# EasyEDA Pro project ProPrj_DiscoTech 6 Current_2026-05-06.epro, schematic Input

## Sheets
1 Volume/EQ: Board Name: Input; Create Date: 2025-11-03; Page Name: Volume/EQ; Project Name: DiscoTech 6 Current; Schematic Name: Input; Update Date: 2026-04-29; Company: EasyEDA.com; Page Size: A4; Version: V1.0
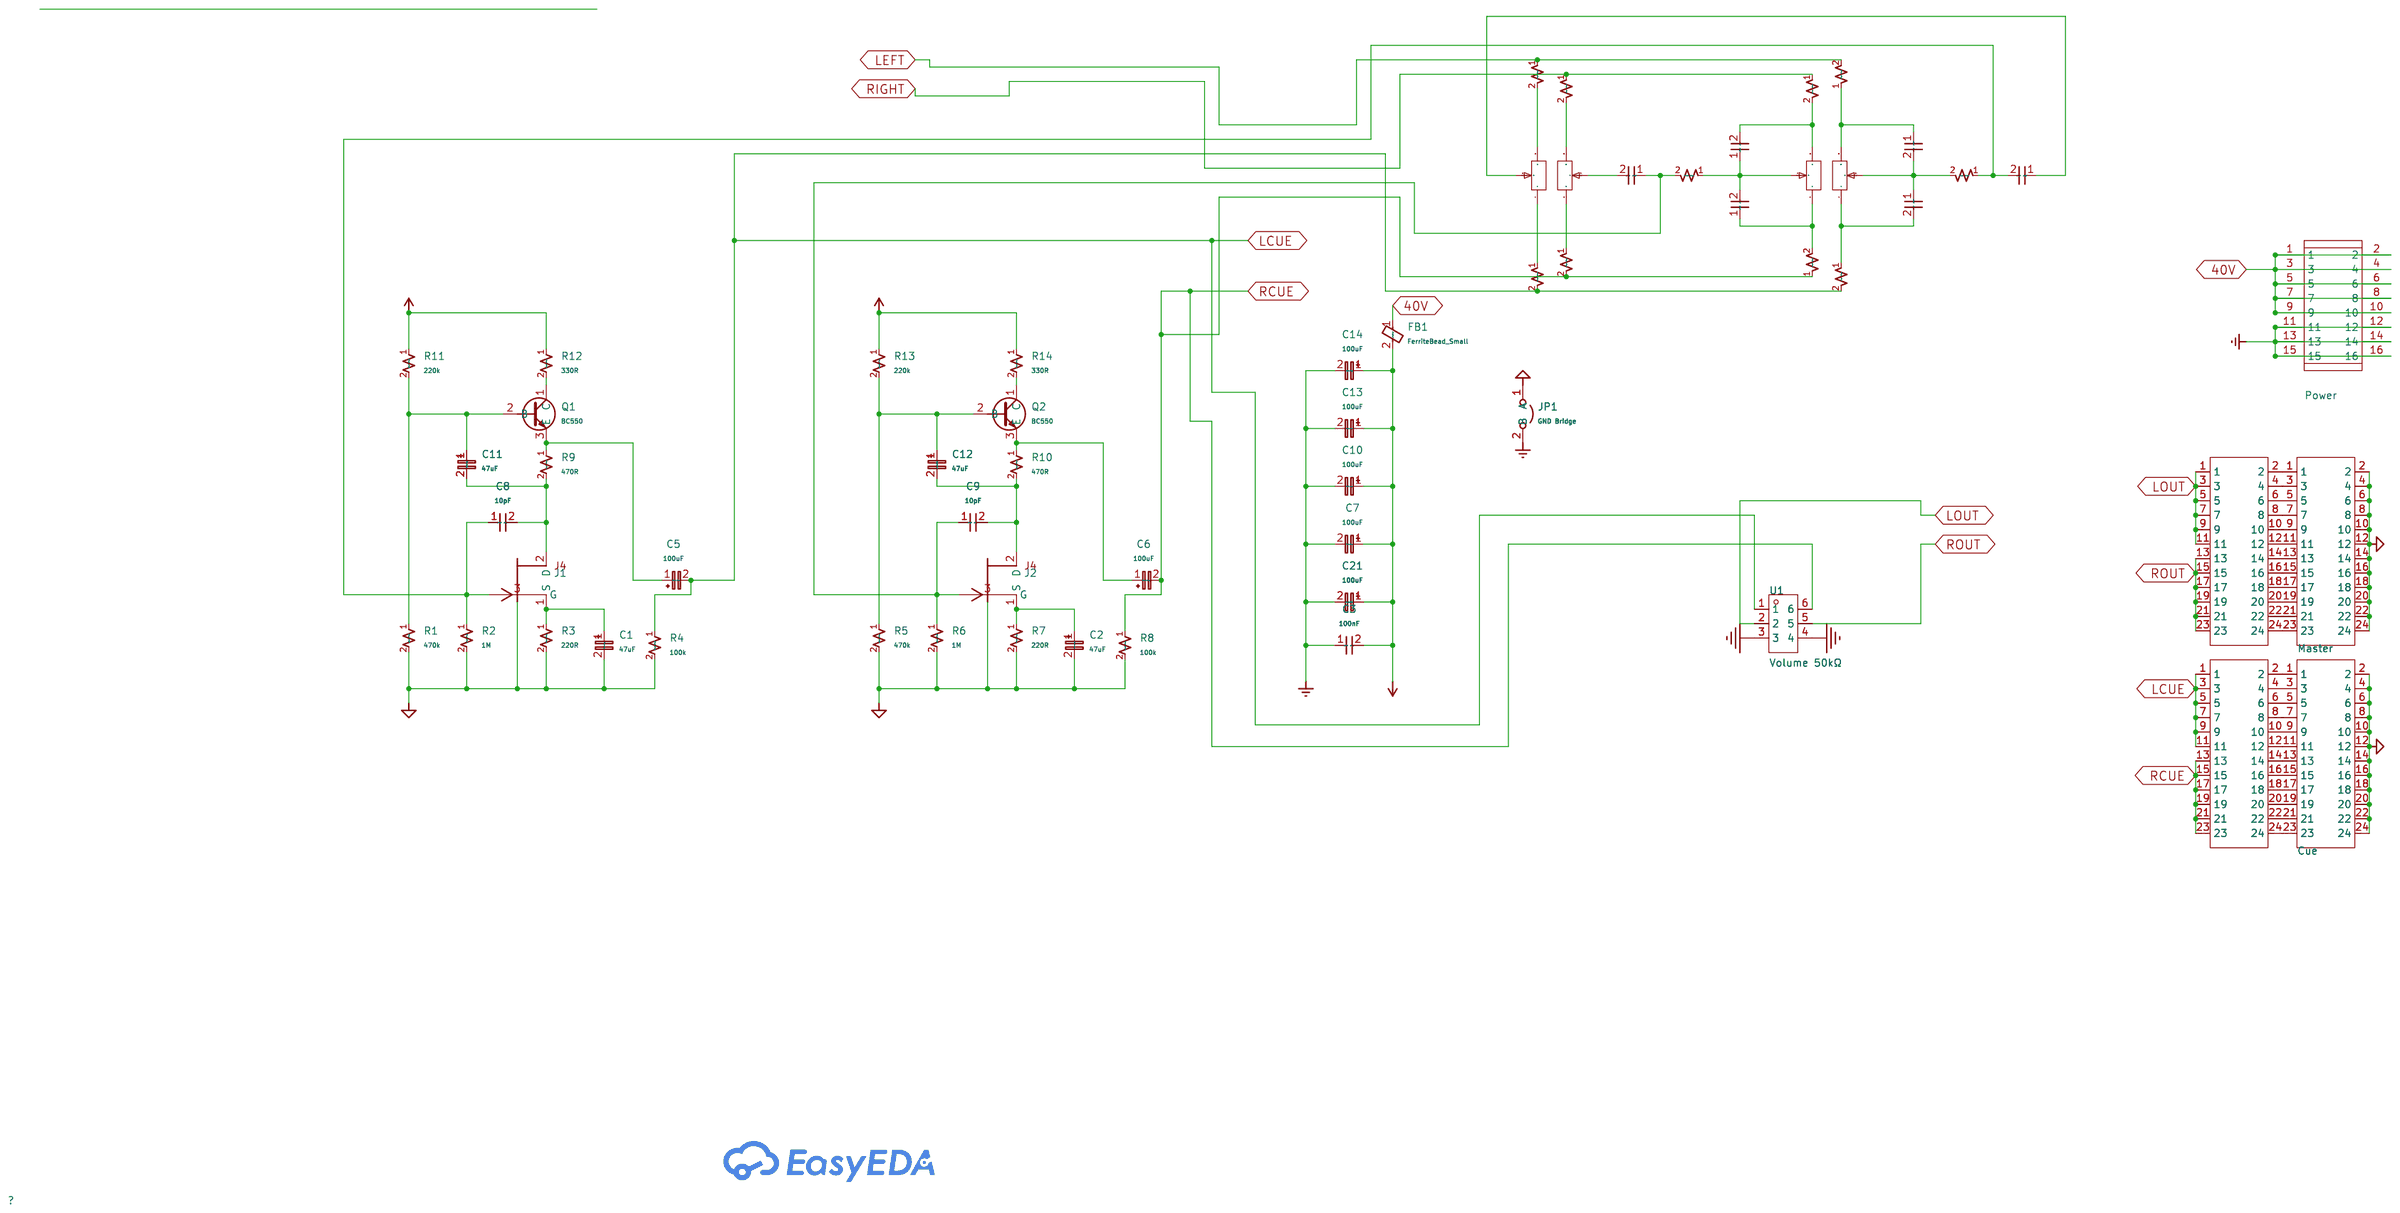
[diagram p6: Volume/EQ]
2 Phono: Page Name: Phono
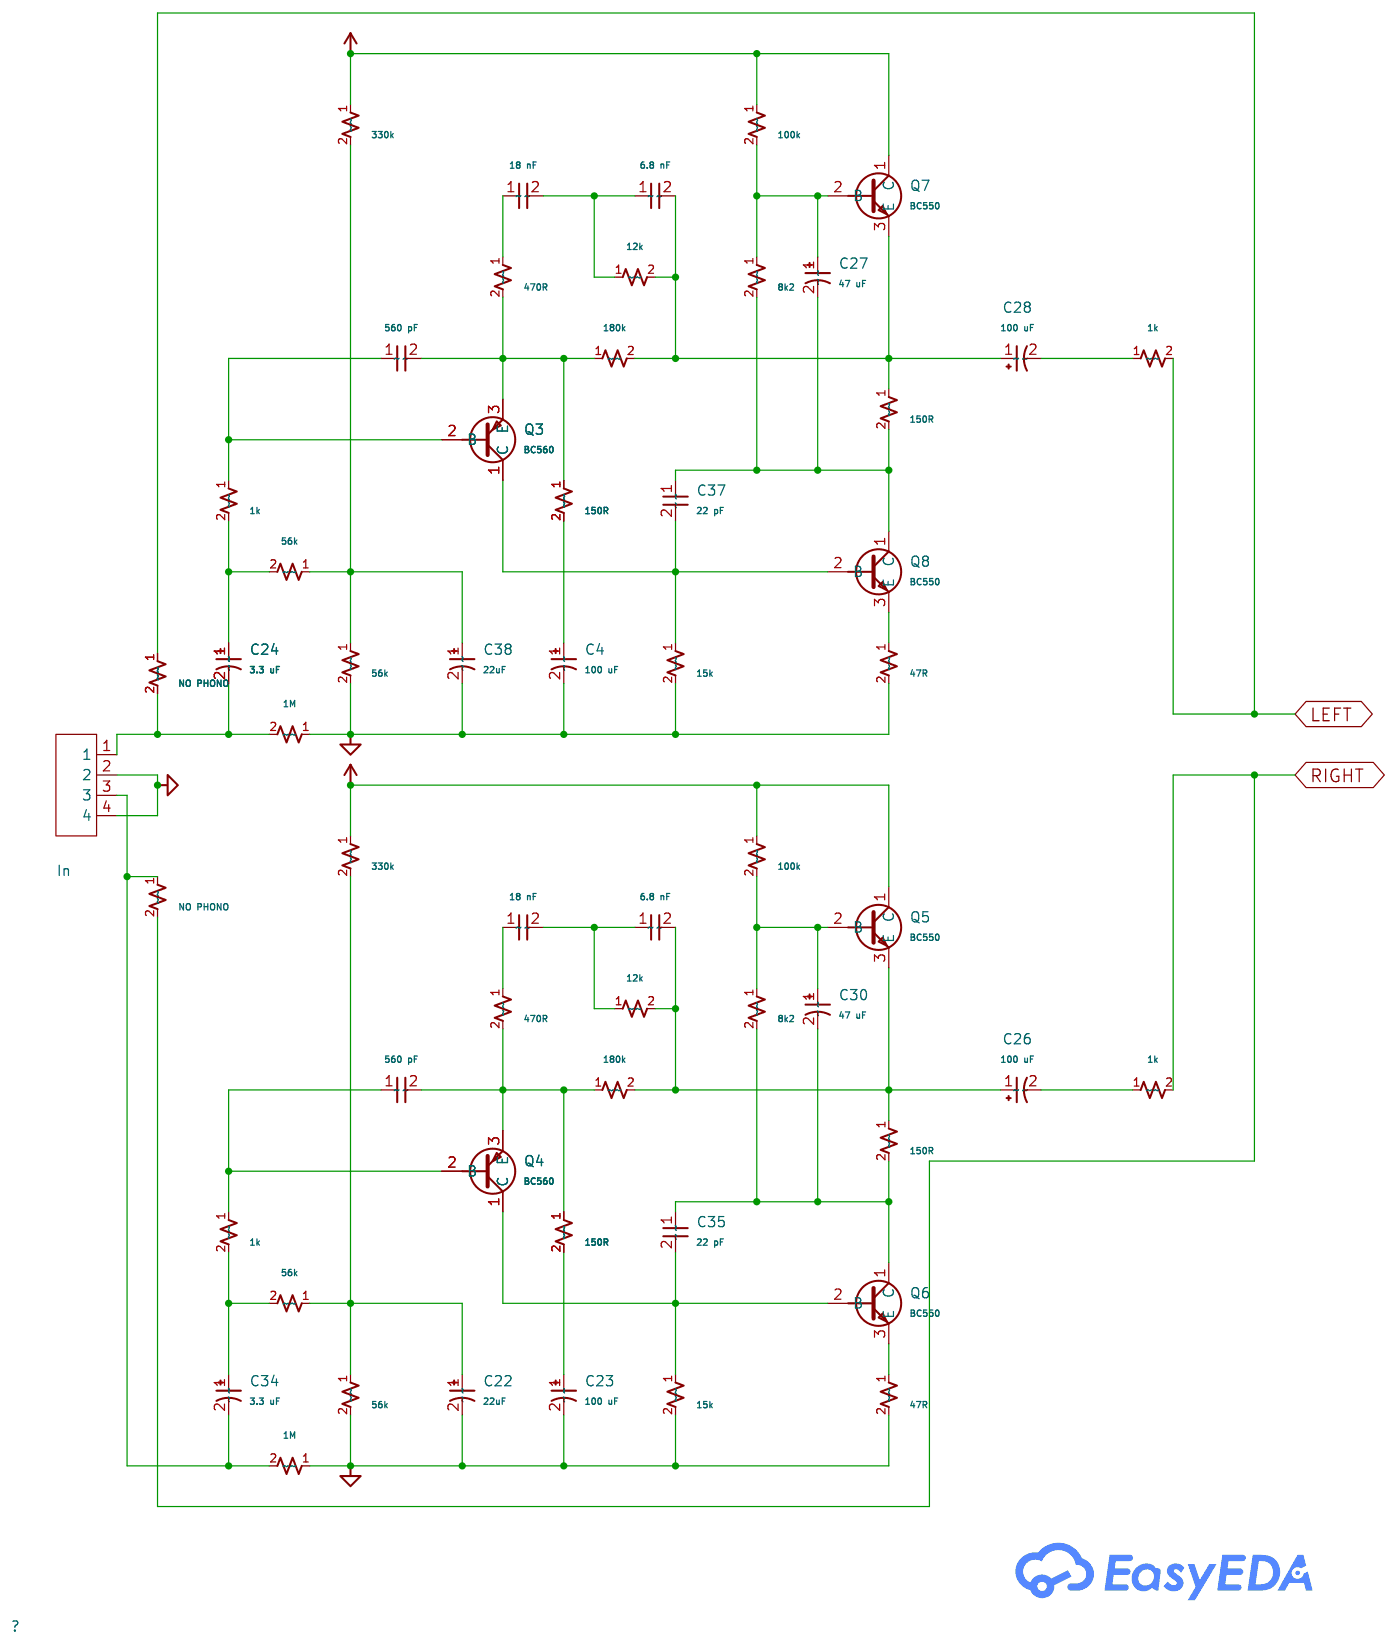
[diagram p7: Phono]

## Parts
sheet Phono
C4  100 uF  [Capacitor_THT:CP_Radial_D10.0mm_P5.00mm]
C22  22uF  [Capacitor_THT:CP_Radial_D6.3mm_P2.50mm]
C23  100 uF  [Capacitor_THT:CP_Radial_D10.0mm_P5.00mm]
C24  3.3 uF  [Capacitor_THT:CP_Radial_Tantal_D5.0mm_P5.00mm]
C25  560 pF  [Capacitor_THT:C_Rect_L10.0mm_W4.0mm_P7.50mm_FKS3_FKP3]
C26  100 uF  [Capacitor_THT:CP_Radial_D10.0mm_P5.00mm]
C27  47 uF  [Capacitor_THT:CP_Radial_D6.3mm_P2.50mm]
C28  100 uF  [Capacitor_THT:CP_Radial_D10.0mm_P5.00mm]
C29  6.8 nF  [Capacitor_THT:C_Rect_L13.0mm_W4.0mm_P10.00mm_FKS3_FKP3_MKS4]
C30  47 uF  [Capacitor_THT:CP_Radial_D6.3mm_P2.50mm]
C31  560 pF  [Capacitor_THT:C_Rect_L10.0mm_W4.0mm_P7.50mm_FKS3_FKP3]
C32  18 nF  [Capacitor_THT:C_Rect_L13.0mm_W6.0mm_P10.00mm_FKS3_FKP3_MKS4]
C33  6.8 nF  [Capacitor_THT:C_Rect_L13.0mm_W4.0mm_P10.00mm_FKS3_FKP3_MKS4]
C34  3.3 uF  [Capacitor_THT:CP_Radial_Tantal_D5.0mm_P5.00mm]
C35  22 pF  [Capacitor_THT:C_Disc_D3.8mm_W2.6mm_P2.50mm]
C36  18 nF  [Capacitor_THT:C_Rect_L13.0mm_W6.0mm_P10.00mm_FKS3_FKP3_MKS4]
C37  22 pF  [Capacitor_THT:C_Disc_D3.8mm_W2.6mm_P2.50mm]
C38  22uF  [Capacitor_THT:CP_Radial_D6.3mm_P2.50mm]
Q3  BC560  [TO-92-3_L4.8-W3.7-P2.60-L_LP0003A]
Q4  BC560  [TO-92-3_L4.8-W3.7-P2.60-L_LP0003A]
Q5  BC550  [TO-92-3_L4.8-W3.7-P2.60-L_LP0003A]
Q6  BC550  [TO-92-3_L4.8-W3.7-P2.60-L_LP0003A]
Q7  BC550  [TO-92-3_L4.8-W3.7-P2.60-L_LP0003A]
Q8  BC550  [TO-92-3_L4.8-W3.7-P2.60-L_LP0003A]
R27  8k2  [Resistor_THT:R_Axial_DIN0207_L6.3mm_D2.5mm_P7.62mm_Horizontal]
R28  150R  [Resistor_THT:R_Axial_DIN0207_L6.3mm_D2.5mm_P7.62mm_Horizontal]
R29  47R  [Resistor_THT:R_Axial_DIN0207_L6.3mm_D2.5mm_P7.62mm_Horizontal]
R30  1k  [Resistor_THT:R_Axial_DIN0207_L6.3mm_D2.5mm_P7.62mm_Horizontal]
R31  56k  [Resistor_THT:R_Axial_DIN0207_L6.3mm_D2.5mm_P7.62mm_Horizontal]
R32  56k  [Resistor_THT:R_Axial_DIN0207_L6.3mm_D2.5mm_P7.62mm_Horizontal]
R33  180k  [Resistor_THT:R_Axial_DIN0207_L6.3mm_D2.5mm_P7.62mm_Horizontal]
R34  150R  [Resistor_THT:R_Axial_DIN0207_L6.3mm_D2.5mm_P7.62mm_Horizontal]
R35  56k  [Resistor_THT:R_Axial_DIN0207_L6.3mm_D2.5mm_P7.62mm_Horizontal]
R36  56k  [Resistor_THT:R_Axial_DIN0207_L6.3mm_D2.5mm_P7.62mm_Horizontal]
R37  180k  [Resistor_THT:R_Axial_DIN0207_L6.3mm_D2.5mm_P7.62mm_Horizontal]
R38  470R  [Resistor_THT:R_Axial_DIN0207_L6.3mm_D2.5mm_P7.62mm_Horizontal]
R39  1M  [Resistor_THT:R_Axial_DIN0207_L6.3mm_D2.5mm_P7.62mm_Horizontal]
R40  1k  [Resistor_THT:R_Axial_DIN0207_L6.3mm_D2.5mm_P7.62mm_Horizontal]
R41  330k  [Resistor_THT:R_Axial_DIN0207_L6.3mm_D2.5mm_P7.62mm_Horizontal]
R42  12k  [Resistor_THT:R_Axial_DIN0207_L6.3mm_D2.5mm_P7.62mm_Horizontal]
R43  1k  [Resistor_THT:R_Axial_DIN0207_L6.3mm_D2.5mm_P7.62mm_Horizontal]
R44  47R  [Resistor_THT:R_Axial_DIN0207_L6.3mm_D2.5mm_P7.62mm_Horizontal]
R45  150R  [Resistor_THT:R_Axial_DIN0207_L6.3mm_D2.5mm_P7.62mm_Horizontal]
R46  15k  [Resistor_THT:R_Axial_DIN0207_L6.3mm_D2.5mm_P7.62mm_Horizontal]
R47  470R  [Resistor_THT:R_Axial_DIN0207_L6.3mm_D2.5mm_P7.62mm_Horizontal]
R48  100k  [Resistor_THT:R_Axial_DIN0207_L6.3mm_D2.5mm_P7.62mm_Horizontal]
R49  330k  [Resistor_THT:R_Axial_DIN0207_L6.3mm_D2.5mm_P7.62mm_Horizontal]
R50  15k  [Resistor_THT:R_Axial_DIN0207_L6.3mm_D2.5mm_P7.62mm_Horizontal]
R51  150R  [Resistor_THT:R_Axial_DIN0207_L6.3mm_D2.5mm_P7.62mm_Horizontal]
R52  8k2  [Resistor_THT:R_Axial_DIN0207_L6.3mm_D2.5mm_P7.62mm_Horizontal]
R53  100k  [Resistor_THT:R_Axial_DIN0207_L6.3mm_D2.5mm_P7.62mm_Horizontal]
R54  1M  [Resistor_THT:R_Axial_DIN0207_L6.3mm_D2.5mm_P7.62mm_Horizontal]
R55  12k  [Resistor_THT:R_Axial_DIN0207_L6.3mm_D2.5mm_P7.62mm_Horizontal]
R56  1k  [Resistor_THT:R_Axial_DIN0207_L6.3mm_D2.5mm_P7.62mm_Horizontal]
R57  NO PHONO  [Resistor_THT:R_Axial_DIN0207_L6.3mm_D2.5mm_P7.62mm_Horizontal]
R58  NO PHONO  [Resistor_THT:R_Axial_DIN0207_L6.3mm_D2.5mm_P7.62mm_Horizontal]
U2  In  [CONN-TH_4P-P2.54_MX128-2.54-GN01-04P-CU-Y-A]
sheet Volume/EQ
C1  47uF  [Capacitor_THT:CP_Radial_D6.3mm_P2.50mm]
C2  47uF  [Capacitor_THT:CP_Radial_D6.3mm_P2.50mm]
C3  100nF  [Capacitor_THT:C_Rect_L7.2mm_W2.5mm_P5.00mm_FKS2_FKP2_MKS2_MKP2]
C5  100uF  [Capacitor_THT:CP_Radial_D10.0mm_P5.00mm]
C6  100uF  [Capacitor_THT:CP_Radial_D10.0mm_P5.00mm]
C7  100uF  [Capacitor_THT:CP_Radial_D10.0mm_P5.00mm]
C8  10pF  [Capacitor_THT:C_Disc_D3.8mm_W2.6mm_P2.50mm]
C9  10pF  [Capacitor_THT:C_Disc_D3.8mm_W2.6mm_P2.50mm]
C10  100uF  [Capacitor_THT:CP_Radial_D10.0mm_P5.00mm]
C11  47uF  [Capacitor_THT:CP_Radial_D6.3mm_P2.50mm]
C12  47uF  [Capacitor_THT:CP_Radial_D6.3mm_P2.50mm]
C13  100uF  [Capacitor_THT:CP_Radial_D10.0mm_P5.00mm]
C14  100uF  [Capacitor_THT:CP_Radial_D10.0mm_P5.00mm]
C15  68nF  [Capacitor_THT:C_Rect_L13.0mm_W6.0mm_P10.00mm_FKS3_FKP3_MKS4]
C16  2.2nF  [Capacitor_THT:C_Rect_L10.0mm_W4.0mm_P7.50mm_FKS3_FKP3]
C17  68nF  [Capacitor_THT:C_Rect_L13.0mm_W6.0mm_P10.00mm_FKS3_FKP3_MKS4]
C18  68nF  [Capacitor_THT:C_Rect_L13.0mm_W6.0mm_P10.00mm_FKS3_FKP3_MKS4]
C19  68nF  [Capacitor_THT:C_Rect_L13.0mm_W6.0mm_P10.00mm_FKS3_FKP3_MKS4]
C20  2.2nF  [Capacitor_THT:C_Rect_L10.0mm_W4.0mm_P7.50mm_FKS3_FKP3]
C21  100uF  [Capacitor_THT:CP_Radial_D10.0mm_P5.00mm]
FB1  FerriteBead_Small  [Inductor_THT:L_Axial_L9.5mm_D4.0mm_P12.70mm_Horizontal_Fastron_SMCC]
H3  PZ254V-12-24P  [HDR-TH_24P-P2.54-V-M-R2-C12-S2.54]
H4  PZ254V-12-24P  [HDR-TH_24P-P2.54-V-M-R2-C12-S2.54]
J1  -  [2n3822]
J2  -  [2n3822]
JP1  GND Bridge  [Connector_PinHeader_2.54mm:PinHeader_1x02_P2.54mm_Vertical]
P1  Power  [CONN-TH_16P-P2.54_C9142]
P2  Master  [IDC-TH_24P-P2.54_ZHOURI_DC3-2.54-24PAL]
P3  Cue  [IDC-TH_24P-P2.54_ZHOURI_DC3-2.54-24PAL]
Q1  BC550  [TO-92-3_L4.8-W3.7-P2.60-L_LP0003A]
Q2  BC550  [TO-92-3_L4.8-W3.7-P2.60-L_LP0003A]
R1  470k  [Resistor_THT:R_Axial_DIN0207_L6.3mm_D2.5mm_P7.62mm_Horizontal]
R2  1M  [Resistor_THT:R_Axial_DIN0207_L6.3mm_D2.5mm_P7.62mm_Horizontal]
R3  220R  [Resistor_THT:R_Axial_DIN0207_L6.3mm_D2.5mm_P7.62mm_Horizontal]
R4  100k  [Resistor_THT:R_Axial_DIN0207_L6.3mm_D2.5mm_P7.62mm_Horizontal]
R5  470k  [Resistor_THT:R_Axial_DIN0207_L6.3mm_D2.5mm_P7.62mm_Horizontal]
R6  1M  [Resistor_THT:R_Axial_DIN0207_L6.3mm_D2.5mm_P7.62mm_Horizontal]
R7  220R  [Resistor_THT:R_Axial_DIN0207_L6.3mm_D2.5mm_P7.62mm_Horizontal]
R8  100k  [Resistor_THT:R_Axial_DIN0207_L6.3mm_D2.5mm_P7.62mm_Horizontal]
R9  470R  [Resistor_THT:R_Axial_DIN0207_L6.3mm_D2.5mm_P7.62mm_Horizontal]
R10  470R  [Resistor_THT:R_Axial_DIN0207_L6.3mm_D2.5mm_P7.62mm_Horizontal]
R11  220k  [Resistor_THT:R_Axial_DIN0207_L6.3mm_D2.5mm_P7.62mm_Horizontal]
R12  330R  [Resistor_THT:R_Axial_DIN0207_L6.3mm_D2.5mm_P7.62mm_Horizontal]
R13  220k  [Resistor_THT:R_Axial_DIN0207_L6.3mm_D2.5mm_P7.62mm_Horizontal]
R14  330R  [Resistor_THT:R_Axial_DIN0207_L6.3mm_D2.5mm_P7.62mm_Horizontal]
R15  Bass 50kΩ  [RES-ADJ-TH_RK16312A0BKH]
R16  Treble 50kΩ  [RES-ADJ-TH_RK16312A0BKH]
R17  6k8  [Resistor_THT:R_Axial_DIN0207_L6.3mm_D2.5mm_P7.62mm_Horizontal]
R18  12k  [Resistor_THT:R_Axial_DIN0207_L6.3mm_D2.5mm_P7.62mm_Horizontal]
R19  3k3  [Resistor_THT:R_Axial_DIN0207_L6.3mm_D2.5mm_P7.62mm_Horizontal]
R20  12k  [Resistor_THT:R_Axial_DIN0207_L6.3mm_D2.5mm_P7.62mm_Horizontal]
R21  12k  [Resistor_THT:R_Axial_DIN0207_L6.3mm_D2.5mm_P7.62mm_Horizontal]
R22  12k  [Resistor_THT:R_Axial_DIN0207_L6.3mm_D2.5mm_P7.62mm_Horizontal]
R23  6k8  [Resistor_THT:R_Axial_DIN0207_L6.3mm_D2.5mm_P7.62mm_Horizontal]
R24  3k3  [Resistor_THT:R_Axial_DIN0207_L6.3mm_D2.5mm_P7.62mm_Horizontal]
R25  3k3  [Resistor_THT:R_Axial_DIN0207_L6.3mm_D2.5mm_P7.62mm_Horizontal]
R26  3k3  [Resistor_THT:R_Axial_DIN0207_L6.3mm_D2.5mm_P7.62mm_Horizontal]
U1  Volume 50kΩ  [RES-ADJ-TH_RK27112A0A16]

## Library data of the parts
C4 C22-C24 C26-C28 C30 C34 C38 = Device_C_Polarized_Small_US: Polarized capacitor, small US symbol; Users: REF**
C3 C8 C9 C15-C20 C25 C29 C31-C33 C35-C37 = Device_C_Small: Unpolarized capacitor, small symbol; Users: REF**
Q3 Q4 = Transistor_BJT_BC560: 0.1A Ic, 45V Vce, PNP Small Signal Transistor, TO-92; Users: REF**; datasheet: https://www.onsemi.com/pub/Collateral/BC550-D.pdf; User doc link: https://www.onsemi.com/pub/Collateral/BC556BTA-D.pdf
Q1 Q2 Q5-Q8 = Transistor_BJT_BC550: 0.1A Ic, 45V Vce, Small Signal NPN Transistor, TO-92; User doc link: https://www.onsemi.com/pub/Collateral/BC550-D.pdf
R1-R14 R17-R58 = Device_R_Small_US: Resistor, small US symbol; Users: REF**
U2 = MX128-2.54-04P-GN01-Cu-Y-A: Number of Positions or Pins:1x4P Pitch:2.54mm Color:Green Mounting Type:Direct Insert Number of Pins:4P Number of Rows:1 Number of PINs Per Row:4 Screw Specification:M1.6 Current Rating:6A Voltage Rating (Max):150V Wire Gauge - AWG:18~24 Wire Gauge - AWG:; LCSC Part Name: 1x4P 2.54mm 直插 排数:1 每排P数:4; Supplier Part: C5188444; Manufacturer: MAX(迈旭); Supplier Footprint: 插件,P=2.54mm; JLCPCB Part Class: Extended Part; Datasheet: https://atta.szlcsc.com/upload/public/pdf/source/20250320/39CF67EAC718F5AC600D0D1AE915BA0E.pdf; Supplier: LCSC; Number of Positions or Pins: 1x4P; Pitch: 2.54mm; Color: Green; Mounting Type: Direct Insert; Number of Pins: 4P; Number of Rows: 1; Number of PINs Per Row: 4; Screw Specification: M1.6; Current Rating: 6A; Voltage Rating (Max): 150V; Wire Gauge - AWG: 18~24; Wire Gauge - mm2: 1; Operating Temperature: -40℃~+105℃
C1 C2 C5-C7 C10-C14 C21 = Device_C_Polarized_Small: Polarized capacitor, small symbol; Users: REF**
FB1 = Device_FerriteBead_Small: Ferrite bead, small symbol; Users: REF**
H3 H4 = PZ254V-12-24P: Pin Structure:2x12P Pitch:2.54mm Row Spacing:2.54mm Circluar Pins/Square Pins:Pin Header Mounting Type:Through Hole Number of Rows:2 Number of Pins:24P Current Rating:- Voltage Rating (Max):- Length of Mating Pin:6mm Insulation Height:2.5mm Length of End; LCSC Part Name: 2x12P 间距:2.54mm 方针 直插; Supplier Part: C492429; Manufacturer: XFCN(兴飞); Supplier Footprint: 插件,P=2.54mm; JLCPCB Part Class: Extended Part; Datasheet: https://item.szlcsc.com/datasheet/PZ254V-12-24P/502985.html; Supplier: LCSC; Pin Structure: 2x12P; Pitch: 2.54mm; Row Spacing: 2.54mm; Circluar Pins/Square Pins: Pin Header; Mounting Type: Through Hole; Number of Rows: 2; Number of Pins: 24P; Length of Mating Pin: 6mm; Insulation Height: 2.5mm; Length of End Connection Pin: 3mm; Contact Material: Brass; Operating Temperature: -40℃~+105℃; Color: Black
J1 J2 = 2n3822
JP1 = Jumper_Jumper_2_Open: Jumper, 2-pole, open; Users: REF**
P1 = 2.54-2*8P弯简牛: Connector Type:IDC Header Pitch:2.54mm Number of Positions or Pins:2x8P Holder Type:Right Angle Row Spacing:2.54mm Number of Rows:2 Number of PINs Per Row:8 Contact Material:- Contact Plating:-; LCSC Part Name: 2.54mm 2x8P 排数:2 每排P数:8; Supplier Part: C9142; Manufacturer: BOOMELE(博穆精密); Supplier Footprint: 弯插,P=2.54mm; JLCPCB Part Class: Extended Part; Datasheet: https://item.szlcsc.com/datasheet/2.54-2*8P%25E5%25BC%25AF%25E7%25AE%2580%25E7%2589%259B/9665.html; Supplier: LCSC; Connector Type: IDC Header; Pitch: 2.54mm; Number of Positions or Pins: 2x8P; Holder Type: Right Angle; Row Spacing: 2.54mm; Number of Rows: 2; Number of PINs Per Row: 8
P2 P3 = DS1013-24RSiB-B-0: Connector Type:IDC Header Pitch:2.54mm Number of Positions or Pins:2x12P Holder Type:Right Angle Number of Rows:2 Number of PINs Per Row:12; LCSC Part Name: 2.54mm 2x12P 排数:2 每排P数:12; Supplier Part: C7430325; Manufacturer: CONNFLY; Supplier Footprint: 弯插,P=2.54mm; JLCPCB Part Class: Extended Part; Datasheet: https://item.szlcsc.com/datasheet/DS1013-24RSiB-B-0/8429959.html; Supplier: LCSC; Connector Type: IDC Header; Pitch: 2.54mm; Number of Positions or Pins: 2x12P; Holder Type: Right Angle; Number of Rows: 2; Number of PINs Per Row: 12; Row Spacing: 2.54mm
R15 R16 = RK16312A0BKH: Resistance: Tolerance:±20% Tolerance:±20%; LCSC Part Name: 50kΩ ±20% 停产; Supplier Part: C231749; Manufacturer: ALPSALPINE(阿尔卑斯阿尔派); Supplier Footprint: 插件; JLCPCB Part Class: Extended Part; Datasheet: https://atta.szlcsc.com/upload/public/pdf/source/20180613/C231749_F0A00B2AA60C42757A3F15B1E5114770.pdf; Supplier: LCSC; Tolerance: ±20%
U1 = RK27112A0A16: Resistance: Tolerance:±20% Tolerance:±20% Rated Voltage:- Power(Watts):- Turns:-; LCSC Part Name: 100kΩ ±20% 3件套; Supplier Part: C470508; Manufacturer: ALPSALPINE(阿尔卑斯阿尔派); Supplier Footprint: DIP-6P,27x24.5mm; JLCPCB Part Class: Extended Part; Datasheet: https://atta.szlcsc.com/upload/public/pdf/source/20191216/C470509_1AC214E673023FF0853974852A92149F.pdf; Supplier: LCSC; Tolerance: ±20%

## Nets
40V: FB1.1 P1.1 P1.2 P1.3 P1.4 P1.5 P1.6 P1.7 P1.8 P1.9 P1.10
GNDREF: C3.1 C7.2 C10.2 C13.2 C14.2 C21.2 JP1.2(B) P1.11 P1.12 P1.13 P1.14 P1.15 P1.16
GNDS: C1.2 C2.2 C4.2 C22.2 C23.2 C38.2 JP1.1(A) P2.2 P2.4 P2.6 P2.8 P2.10 P2.12 P2.14 P2.16 P2.18 P2.20 P2.22 P2.24 P3.2 P3.4 P3.6 P3.8 P3.10 P3.12 P3.14 P3.16 P3.18 P3.20 P3.22 P3.24 R1.2 R2.2 R3.2 R4.2 R5.2 R6.2 R7.2 R8.2 R29.2 R32.2 R36.2 R39.1 R44.2 R46.2 R50.2 R54.1 U1.3 U1.4 U2.2 U2.4
LCUE: C5.2 H4.1 H4.3 H4.5 H4.7 H4.9 H4.11 R4.1 R20.2 R26.2 U1.1
LEFT: R22.2 R25.1 R56.2 R57.1
LOUT: H3.1 H3.3 H3.5 H3.7 H3.9 H3.11 U1.2
RCUE: C6.2 H4.13 H4.15 H4.17 H4.19 H4.21 H4.23 R8.1 R18.1 R24.2 U1.6
RIGHT: R19.1 R21.1 R30.2 R58.2
ROUT: H3.13 H3.15 H3.17 H3.19 H3.21 H3.23 U1.5
VDC: C3.2 C7.1 C10.1 C13.1 C14.1 C21.1 FB1.2 Q5.1(C) Q7.1(C) R11.1 R12.1 R13.1 R14.1 R41.1 R48.1 R49.1 R53.1
$1N449: C8.1 C20.2 J1.3(G) R2.1 R23.1
$1N454: C8.2 C11.2 J1.2(D) R9.2
$1N461: C5.1 Q1.3(E) R9.1
$1N470: C11.1 Q1.2(B) R1.1 R11.2
$1N476: C1.1 J1.1(S) R3.1
$1N480: Q1.1(C) R12.2
$1N855: C9.1 C16.1 J2.3(G) R6.1 R17.2
$1N860: C9.2 C12.2 J2.2(D) R10.2
$1N867: C6.1 Q2.3(E) R10.1
$1N876: C12.1 Q2.2(B) R5.1 R13.2
$1N882: C2.1 J2.1(S) R7.1
$1N886: Q2.1(C) R14.2
$1N6655: C18.1 R15.6 R22.1
$1N6656: C19.2 R15.4 R20.1
$1N6657: C18.2 C19.1 R15.5 R23.2
$1N6659: C15.2 R15.3 R21.2
$1N6660: C17.1 R15.1 R18.2
$1N6661: C15.1 C17.2 R15.2 R17.1
$1N6663: C16.2 R16.2
$1N6664: C20.1 R16.5
$1N6665: R16.3 R19.2
$1N6666: R16.1 R24.1
$1N6667: R16.4 R26.1
$1N6668: R16.6 R25.2
$1N19497: H3.24 P2.23
$1N19499: H3.22 P2.21
$1N19501: H3.20 P2.19
$1N19503: H3.18 P2.17
$1N19505: H3.16 P2.15
$1N19507: H3.14 P2.13
$1N19509: H3.12 P2.11
$1N19511: H3.10 P2.9
$1N19513: H3.8 P2.7
$1N19515: H3.6 P2.5
$1N19517: H3.4 P2.3
$1N19519: H3.2 P2.1
$1N19633: H4.24 P3.23
$1N19635: H4.22 P3.21
$1N19637: H4.20 P3.19
$1N19639: H4.18 P3.17
$1N19641: H4.16 P3.15
$1N19643: H4.14 P3.13
$1N19645: H4.12 P3.11
$1N19647: H4.10 P3.9
$1N19649: H4.8 P3.7
$1N19651: H4.6 P3.5
$1N19653: H4.4 P3.3
$1N19655: H4.2 P3.1
$2N1482: C38.1 R31.1 R36.1 R49.2
$2N1488: C25.1 Q3.2(B) R40.1
$2N1493: C29.1 C32.2 R55.1
$2N1504: C34.1 R35.2 R43.2
$2N1508: C27.1 Q7.2(B) R52.1 R53.2
$2N1517: C26.1 C29.2 Q5.3(E) R28.1 R33.2 R55.2
$2N1537: C30.2 C35.1 Q6.1(C) R27.2 R28.2
$2N1546: C25.2 Q3.3(E) R37.1 R47.2 R51.1
$2N1556: C24.1 R31.2 R40.2
$2N1566: C32.1 R38.1
$2N1568: C27.2 C37.1 Q8.1(C) R45.2 R52.2
$2N1577: C37.2 Q3.1(C) Q8.2(B) R46.1
$2N1583: C33.1 C36.2 R42.1
$2N1588: C30.1 Q5.2(B) R27.1 R48.2
$2N1594: C26.2 R30.1
$2N1596: C35.2 Q4.1(C) Q6.2(B) R50.1
$2N1602: C28.1 C33.2 Q7.3(E) R37.2 R42.2 R45.1
$2N1622: C22.1 R32.1 R35.1 R41.2
$2N1628: C31.2 Q4.3(E) R33.1 R34.1 R38.2
$2N1635: C28.2 R56.1
$2N1637: C31.1 Q4.2(B) R43.1
$2N1642: Q6.3(E) R29.1
$2N1644: C23.1 R34.2
$2N1646: C36.1 R47.1
$2N1648: Q8.3(E) R44.1
$2N1650: C4.1 R51.2
$2N5209: C24.2 R54.2 R57.2 U2.1
$2N5229: C34.2 R39.2 R58.1 U2.3
